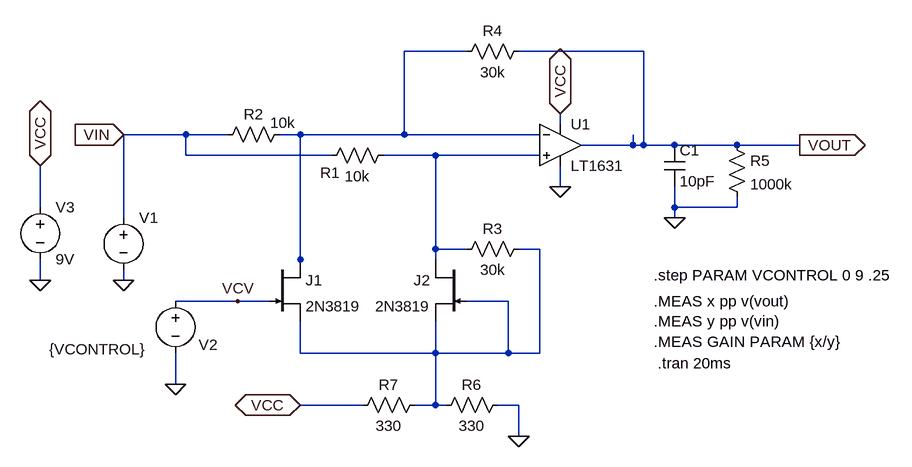
[diagram p0: schematic VoltageControlledAmplifer_JFETasc.asc]
VoltageControlledAmplifer_JFETasc.asc, the LTspice schematic file:
Version 4
SHEET 1 1876 680
WIRE 384 -160 288 -160
WIRE 656 -160 464 -160
WIRE 528 -48 528 -64
WIRE -48 -32 -144 -32
WIRE 16 -32 -48 -32
WIRE 128 -32 96 -32
WIRE 288 -32 288 -160
WIRE 288 -32 128 -32
WIRE 496 -32 288 -32
WIRE 640 -16 640 -32
WIRE 640 -16 560 -16
WIRE 656 -16 656 -160
WIRE 656 -16 640 -16
WIRE 704 -16 656 -16
WIRE 800 -16 704 -16
WIRE 896 -16 800 -16
WIRE -48 0 -48 -32
WIRE 176 0 -48 0
WIRE 336 0 256 0
WIRE 496 0 336 0
WIRE 528 48 528 16
WIRE -272 80 -272 16
WIRE 704 80 704 48
WIRE 800 80 800 64
WIRE 800 80 704 80
WIRE -144 96 -144 -32
WIRE 704 96 704 80
WIRE 336 144 336 0
WIRE 384 144 336 144
WIRE 496 144 464 144
WIRE 128 160 128 -32
WIRE 336 160 336 144
WIRE 128 176 128 160
WIRE -272 192 -272 160
WIRE -144 192 -144 176
WIRE 32 224 -64 224
WIRE 80 224 32 224
WIRE 448 224 384 224
WIRE 128 304 128 256
WIRE 336 304 336 256
WIRE 336 304 128 304
WIRE 448 304 448 224
WIRE 448 304 336 304
WIRE 496 304 496 144
WIRE 496 304 448 304
WIRE -64 352 -64 304
WIRE 224 384 128 384
WIRE 336 384 336 304
WIRE 336 384 304 384
WIRE 352 384 336 384
WIRE 464 384 432 384
WIRE 464 432 464 384
FLAG -272 192 0
FLAG 464 432 0
FLAG -64 352 0
FLAG -144 192 0
FLAG 528 48 0
FLAG -272 16 VCC
IOPIN -272 16 BiDir
FLAG 528 -64 VCC
IOPIN 528 -64 BiDir
FLAG 704 96 0
FLAG 896 -16 VOUT
IOPIN 896 -16 Out
FLAG -144 -32 VIN
IOPIN -144 -32 In
FLAG 32 224 VCV
FLAG 128 384 VCC
IOPIN 128 384 BiDir
SYMBOL njf 80 160 R0
SYMATTR InstName J1
SYMATTR Value 2N3819
SYMBOL njf 384 160 M0
SYMATTR InstName J2
SYMATTR Value 2N3819
SYMBOL res 272 -16 R90
WINDOW 0 58 98 VBottom 2
WINDOW 3 32 56 VTop 2
SYMATTR InstName R1
SYMATTR Value 10k
SYMBOL res 112 -48 R90
WINDOW 0 0 56 VBottom 2
WINDOW 3 -18 11 VTop 2
SYMATTR InstName R2
SYMATTR Value 10k
SYMBOL res 480 128 R90
WINDOW 0 0 56 VBottom 2
WINDOW 3 32 56 VTop 2
SYMATTR InstName R3
SYMATTR Value 30k
SYMBOL res 480 -176 R90
WINDOW 0 0 56 VBottom 2
WINDOW 3 32 56 VTop 2
SYMATTR InstName R4
SYMATTR Value 30k
SYMBOL voltage -144 80 R0
WINDOW 3 41 66 Invisible 2
WINDOW 123 0 0 Left 2
WINDOW 39 0 0 Left 2
SYMATTR InstName V1
SYMATTR Value SINE(4.5 200mV 1000Hz)
SYMBOL voltage -64 208 R0
WINDOW 0 36 83 Left 2
WINDOW 3 -194 90 Left 2
WINDOW 123 0 0 Left 2
WINDOW 39 0 0 Left 2
SYMATTR InstName V2
SYMATTR Value {VCONTROL}
SYMBOL voltage -272 64 R0
WINDOW 123 0 0 Left 2
WINDOW 39 0 0 Left 2
SYMATTR InstName V3
SYMATTR Value 9V
SYMBOL Opamps\\LT1631 528 -80 R0
SYMATTR InstName U1
SYMBOL cap 688 -16 R0
SYMATTR InstName C1
SYMATTR Value 10pF
SYMBOL res 784 -32 R0
SYMATTR InstName R5
SYMATTR Value 1000k
SYMBOL res 448 368 R90
WINDOW 0 0 56 VBottom 2
WINDOW 3 32 56 VTop 2
SYMATTR InstName R6
SYMATTR Value 330
SYMBOL res 320 368 R90
WINDOW 0 0 56 VBottom 2
WINDOW 3 32 56 VTop 2
SYMATTR InstName R7
SYMATTR Value 330
TEXT 678 320 Left 2 !.tran 20ms
TEXT 672 184 Left 2 !.step PARAM VCONTROL 0 9 .25
TEXT 672 224 Left 2 !.MEAS x pp v(vout)\n.MEAS y pp v(vin)\n.MEAS GAIN PARAM {x/y}

The netlist it stands for:
* VoltageControlledAmplifer_JFETasc.asc
J1 N001 VCV N003 2N3819
J2 N002 N003 N003 2N3819
R1 N002 VIN 10k
R2 N001 VIN 10k
R3 N003 N002 30k
R4 VOUT N001 30k
V1 VIN 0 SINE(4.5 200mV 1000Hz)
V2 VCV 0 {VCONTROL}
V3 VCC 0 9V
XU1 N002 N001 VCC 0 VOUT LT1630  ; LT1631, pins In+ In- V+ V- OUT
C1 VOUT 0 10pF
R5 VOUT 0 1000k
R6 0 N003 330
R7 N003 VCC 330
.model NJF NJF
.model PJF PJF
.lib standard.jft
.tran 20ms
.step PARAM VCONTROL 0 9 .25
.MEAS x pp v(vout)
.MEAS y pp v(vin)
.MEAS GAIN PARAM {x/y}
.lib LTC.lib
.backanno
.end